# Altium schematic sheet 4_demodulation.SchDoc
size A; SheetNumber: 7; SheetTotal: 9
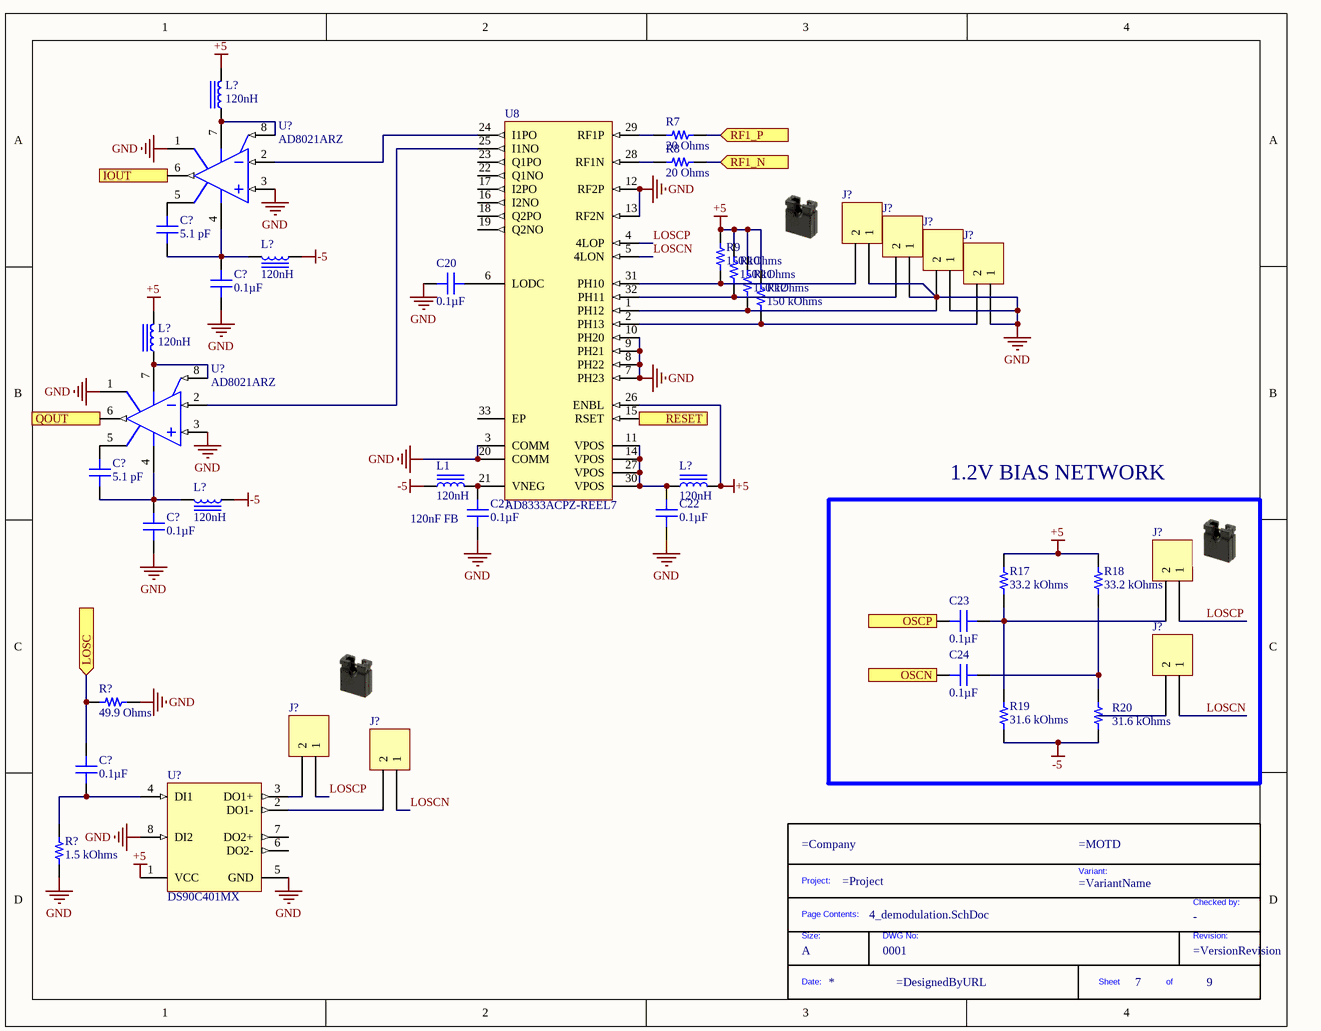
[diagram p0: 4_demodulation.SchDoc]

## Parts
(Parts that share a designator on the sheet are numbered #1, #2 ... from top to bottom, then left to right.)
*?  DWG No: 0001  Size: A  (hidden comment: TitleBlock)  (graphical)
C20  0.1µF  [CAP 1206_3216 - 1.0MM]
C21  0.1µF  [CAP 1206_3216 - 1.0MM]
C22  0.1µF  [CAP 1206_3216 - 1.0MM]
C23  0.1µF  [CAP 1206_3216 - 1.0MM]
C24  0.1µF  [CAP 1206_3216 - 1.0MM]
C?#1  5.1 pF  [CAP 1206_3216 - 0.8MM]
C?#2  0.1µF  [CAP 1206_3216 - 1.0MM]
C?#3  5.1 pF  [CAP 1206_3216 - 0.8MM]
C?#4  0.1µF  [CAP 1206_3216 - 1.0MM]
C?#5  0.1µF  [CAP 1206_3216 - 1.0MM]
J?#1  0022272021  [MOLEX KK 0022272021]  (value not drawn)
J?#2  0022272021  [MOLEX KK 0022272021]  (value not drawn)
J?#3  0022272021  [MOLEX KK 0022272021]  (value not drawn)
J?#4  0022272021  [MOLEX KK 0022272021]  (value not drawn)
J?#5  0022272021  [MOLEX KK 0022272021]  (value not drawn)
J?#6  0022272021  [MOLEX KK 0022272021]  (value not drawn)
J?#7  0022272021  [MOLEX KK 0022272021]  (value not drawn)
J?#8  0022272021  [MOLEX KK 0022272021]  (value not drawn)
L1  120nH  [IND 0603_1608 RF WW]
L?#1  120nH  [IND 0603_1608 RF WW]
L?#2  120nH  [IND 0603_1608 RF WW]
L?#3  120nH  [IND 0603_1608 RF WW]
L?#4  120nH  [IND 0603_1608 RF WW]
L?#5  120nH  [IND 0603_1608 RF WW]
R7  20 Ohms  [RES 1206_3216]
R8  20 Ohms  [RES 1206_3216]
R9  150 kOhms  [RES 1206_3216]
R10  150 kOhms  [RES 1206_3216]
R11  150 kOhms  [RES 1206_3216]
R12  150 kOhms  [RES 1206_3216]
R17  33.2 kOhms  [RES 1206_3216]
R18  33.2 kOhms  [RES 1206_3216]
R19  31.6 kOhms  [RES 1206_3216]
R20  31.6 kOhms  [RES 1206_3216]
R?#1  49.9 Ohms  [RES 1206_3216]
R?#2  1.5 kOhms  [RES 1206_3216]
U8  AD8333ACPZ-REEL7  [ADI-CP-32-2_L]
U?#1  AD8021ARZ  [ADI-R-8_N]
U?#2  AD8021ARZ  [ADI-R-8_N]
U?#3  DS90C401MX  [D0008A_N]

## Blocks framed on the sheet
1.2V BIAS NETWORK: C23 C24 J?#5 J?#6 R17-R20

## Ports
IOUT (out), LOSC (in), OSCN (in), OSCP (in), QOUT (out), RESET (in), RF1_N (in), RF1_P (in)

## Nets
+5: L?#1.2 L?#3.2 L?#4.2 R9.2 R10.2 R11.2 R12.2 R17.2 R18.2 U8.26(ENBL) U?#3.1(VCC)
-5: L1.1 L?#2.1 L?#5.1 R19.2 R20.1
GND: C20.2 C21.1 C22.1 C?#2.2 C?#4.2 J?#1.1 J?#2.1 J?#3.1 J?#4.1 R?#1.2 R?#2.2 U8.3(COMM) U8.7(PH23) U8.8(PH22) U8.9(PH21) U8.10(PH20) U8.12(RF2P) U8.13(RF2N) U8.20(COMM) U?#1.1(LOGIC_REFERENCE) U?#1.3(+IN) U?#2.1(LOGIC_REFERENCE) U?#2.3(+IN) U?#3.5(GND) U?#3.8(DI2)
IOUT: U?#1.6(VOUT) ; port IOUT
LOSC: C?#5.2 R?#1.1 ; port LOSC
LOSCN: J?#6.1 J?#8.1 U8.5(4LON)
LOSCP: J?#5.1 J?#7.1 U8.4(4LOP)
OSCN: C24.2 ; port OSCN
OSCP: C23.2 ; port OSCP
QOUT: U?#2.6(VOUT) ; port QOUT
RESET: U8.15(RSET) ; port RESET
RF1_N: R8.2 ; port RF1_N
RF1_P: R7.2 ; port RF1_P
NetC20_1: C20.1 U8.6(LODC)
NetC21_2: C21.2 L1.2 U8.21(VNEG)
NetC22_2: C22.2 L?#4.1 U8.11(VPOS) U8.14(VPOS) U8.27(VPOS) U8.30(VPOS)
NetC23_1: C23.1 J?#5.2 R17.1 R19.1
NetC24_1: C24.1 R18.1 R20.2
NetC?#1_1: C?#1.1 C?#2.1 L?#2.2 U?#1.4(-VS)
NetC?#1_2: C?#1.2 U?#1.5(CCOMP)
NetC?#3_1: C?#3.1 C?#4.1 L?#5.2 U?#2.4(-VS)
NetC?#3_2: C?#3.2 U?#2.5(CCOMP)
NetC?#5_1: C?#5.1 R?#2.1 U?#3.4(DI1)
NetJ?#1_2: J?#1.2 R9.1 U8.31(PH10)
NetJ?#2_2: J?#2.2 R10.1 U8.32(PH11)
NetJ?#3_2: J?#3.2 R11.1 U8.1(PH12)
NetJ?#4_2: J?#4.2 R12.1 U8.2(PH13)
NetJ?#7_2: J?#7.2 U?#3.3(DO1+)
NetJ?#8_2: J?#8.2 U?#3.2(DO1-)
NetL?#1_1: L?#1.1 U?#1.7(+VS) U?#1.8(~{DISABLE})
NetL?#3_1: L?#3.1 U?#2.7(+VS) U?#2.8(~{DISABLE})
NetR7_1: R7.1 U8.29(RF1P)
NetR8_1: R8.1 U8.28(RF1N)
NetU8_24: U8.24(I1PO) U?#1.2(-IN)
NetU8_25: U8.25(I1NO) U?#2.2(-IN)

Not connected (* = marked no-connect by the designer): J?#6 2; U8 16(I2NO) 17(I2PO) 18(Q2PO) 19(Q2NO) 22(Q1NO) 23(Q1PO) 33(EP); U?#3 6(DO2-) 7(DO2+)

## Notes on the sheet
- 120nF FB
- (in symbol TitleBlock) Project:; Variant:; Checked by:; Page Contents:; Size:; DWG No:; Revision:; Date:; Sheet; of

## Library data of the parts
*? = TitleBlock: Standard Title Block; Checked by: -
C20-C24 C?#2 C?#4 C?#5 = 12065C104JAT2A: CAP CER 0.1UF 50V X7R 1206; manufacturer: AVX Corporation; Tolerance: ±5%; Part Number: 12065C104JAT2A; Value: 0.1µF; Applications: General Purpose; Capacitance: 0.1µF; componentlink1description: Datasheet; componentlink1url: http://datasheets.avx.com/X7RDielectric.pdf; componentlink2description: DigiKey Link; componentlink2url: http://digikey.com/product-detail/en/avx-corporation/12065C104JAT2A/478-3797-1-ND/1116495; Device Package: 1206 (3216 Metric); lastupdated: 2020-09-02 01:05:06; Lifecycle Status: Active; Minimum Order: 1; Mounting Type: Surface Mount, MLCC; Operating Temperature: -55°C ~ 125°C; Package / Case: 1206 (3216 Metric); packaging: TapeAndReel; partid: 19088; Part Status: Active; price: 0.06; series: -; Size / Dimension: 0.126" L x 0.063" W (3.20mm x 1.60mm); Supplier 1: DigiKey; Supplier Part Number 1: 478-3797-1-ND; Temperature Coefficient: X7R; Thickness (Max): 0.037" (0.94mm); Voltage - Rated: 50V
C?#1 C?#3 = C1206C519C5GAC7800: CAP CER 5.1PF 50V C0G/NP0 1206; manufacturer: KEMET; Temperature Coefficient: C0G, NP0; Tolerance: ±0.25pF; Part Number: C1206C519C5GAC7800; Value: 5.1 pF; Applications: General Purpose; Capacitance: 5.1 pF; componentlink1description: Datasheet; componentlink1url: https://api.kemet.com/component-edge/download/datasheet/C1206C519C5GACTU.pdf; componentlink2description: DigiKey Link; componentlink2url: https://www.digikey.com/en/products/detail/kemet/C1206C519C5GAC7800/411185; Device Package: 1206 (3216 Metric); Features: Low ESL; lastupdated: 2023-04-30 19:15:17; Lifecycle Status: Active; Minimum Order: 1; Mounting Type: Surface Mount, MLCC; Operating Temperature: -55°C ~ 125°C; Package / Case: 1206 (3216 Metric); packaging: TapeAndReel; partid: 30067; Part Status: Active; price: 0.16; series: SMD Comm C0G; Size / Dimension: 0.126" L x 0.063" W (3.20mm x 1.60mm); Supplier 1: DigiKey; Supplier Part Number 1: 399-C1206C519C5GAC7800CT-ND; Thickness (Max): 0.035" (0.88mm); Voltage - Rated: 50V
J?#1-J?#8 = 0022272021: CONN HEADER VERT 2POS 2.54MM; Manufacturer: Molex; Contact Length - Mating: 0.295" (7.49mm); Contact Length - Post: 0.140" (3.56mm); Material Flammability Rating: UL94 V-0; Number of Positions: 2; Number of Positions Loaded: All; Overall Contact Length: 0.560" (14.22mm); Pitch - Mating: 0.100" (2.54mm); Shrouding: Shrouded - 1 Wall; Style: Board to Cable/Wire; Part Number: 0022272021; ComponentLink1Description: Datasheet; ComponentLink1URL: https://www.molex.com/pdm_docs/sd/022272021_sd.pdf; ComponentLink2Description: DigiKey Link; ComponentLink2URL: http://digikey.com/product-detail/en/molex/0022272021/WM4111-ND/1130577; Connector Type: Header; Contact Finish - Mating: Tin; Contact Finish - Post: Tin; Contact Finish Thickness - Mating: 100.0µin (2.54µm); Contact Material: Brass; Contact Shape: Square; Contact Type: Male Pin; Fastening Type: Friction Lock; Insulation Color: Natural; Insulation Height: 0.461" (11.70mm); Insulation Material: Polyamide (PA), Nylon; LastUpdated: 2020-01-12 23:51:43; Lifecycle Status: Active; Minimum Order: 1; Mounting Type: Through Hole; Number of Rows: 1; Packaging: Bulk; PartId: 76; Part Status: Active; Price: 0.27; Series: KK 6410; Supplier 1: DigiKey; Supplier Part Number 1: WM4111-ND; Termination: Solder
L1 = 744761212C: FIXED IND 120NH 300MA 650 MOHM; Manufacturer: Würth Elektronik; DC Resistance (DCR): 650mOhm Max; Frequency - Self Resonant: 1.3GHz; Inductance Frequency - Test: 150MHz; Material - Core: Ceramic; Q @ Freq: 30 @ 150MHz; Shielding: Unshielded; Tolerance: ±5%; Type: Wirewound; Part Number: 744761212C; ComponentLink1Description: Datasheet; ComponentLink1URL: https://katalog.we-online.de/pbs/datasheet/744761212C.pdf; ComponentLink2Description: DigiKey Link; ComponentLink2URL: http://digikey.com/product-detail/en/w-rth-elektronik/744761212C/732-1768-1-ND/1994348; Current Rating (Amps): 300mA; Device Package: 0603 (1608 Metric); Height - Seated (Max): 0.043" (1.10mm); Inductance: 120nH; LastUpdated: 2020-09-06 11:05:21; Lifecycle Status: Active; Minimum Order: 1; Mounting Type: Surface Mount; Operating Temperature: -40°C ~ 125°C; Package / Case: 0603 (1608 Metric); Packaging: TapeAndReel; PartId: 1481; Part Status: Active; Price: 0.23; Series: WE-KI; Size / Dimension: 0.065" L x 0.045" W (1.65mm x 1.15mm); Supplier 1: DigiKey; Supplier Part Number 1: 732-1768-1-ND; Supplier Device Package: 0603 (1608 Metric); Value: 120nH
L?#1-L?#5 = LQW18CAR12J00D: FIXED IND 120NH 1500MA 58MOHM; Manufacturer: Murata Electronics; Current Rating (Amps): 1.5A; DC Resistance (DCR): 58mOhm Max; Frequency - Self Resonant: 1.5GHz; Inductance Frequency - Test: 10MHz; Material - Core: Ferrite; Shielding: Unshielded; Tolerance: ±5%; Type: Wirewound; Part Number: LQW18CAR12J00D; ComponentLink1Description: Datasheet; ComponentLink1URL: https://search.murata.co.jp/Ceramy/image/img/P02/JELF243A-0159.pdf; ComponentLink2Description: DigiKey Link; ComponentLink2URL: http://digikey.com/product-detail/en/murata-electronics/LQW18CAR12J00D/490-18177-1-ND/9742079; Device Package: 0603 (1608 Metric); Height - Seated (Max): 0.037" (0.95mm); Inductance: 120nH; LastUpdated: 2020-09-06 11:05:19; Lifecycle Status: Active; Minimum Order: 1; Mounting Type: Surface Mount; Operating Temperature: -40°C ~ 85°C; Package / Case: 0603 (1608 Metric); Packaging: TapeAndReel; PartId: 1197; Part Status: Active; Price: 0.22; Series: LQW18; Size / Dimension: 0.063" L x 0.031" W (1.60mm x 0.80mm); Supplier 1: DigiKey; Supplier Part Number 1: 490-18177-1-ND; Supplier Device Package: 0603; Value: 120nH
R7 R8 = RNCP1206FTD20R0: RES 20 OHM 1% 1/2W 1206; Manufacturer: Stackpole Electronics Inc; Power (Watts): 0.5W, 1/2W; Temperature Coefficient: ±100ppm/°C; Part Number: RNCP1206FTD20R0; ComponentLink1Description: Datasheet; ComponentLink1URL: https://www.seielect.com/catalog/sei-rncp.pdf; ComponentLink2Description: DigiKey Link; ComponentLink2URL: https://www.digikey.com/en/products/detail/stackpole-electronics-inc/RNCP1206FTD20R0/2240306; Composition: Thin Film; Device Package: 1206 (3216 Metric); Features: Anti-Sulfur; Height - Seated (Max): 0.025" (0.65mm); LastUpdated: 2022-09-19 13:29:44; Lifecycle Status: Active; Minimum Order: 1; Number of Terminations: 2; Operating Temperature: -55°C ~ 155°C; Package / Case: 1206 (3216 Metric); Packaging: TapeAndReel; PartId: 29216; Part Status: Active; Price: 0.01; Resistance: 20 Ohms; Series: RNCP; Size / Dimension: 0.122" L x 0.059" W (3.10mm x 1.50mm); Supplier 1: DigiKey; Supplier Part Number 1: RNCP1206FTD20R0CT-ND; Supplier Device Package: 1206; Tolerance: ±1%; Value: 20 Ohms
R9-R12 = KTR18EZPF1503: RES SMD 150K OHM 1% 1/4W 1206; Manufacturer: Rohm Semiconductor; Power (Watts): 0.25W, 1/4W; Temperature Coefficient: ±100ppm/°C; Part Number: KTR18EZPF1503; ComponentLink1Description: Datasheet; ComponentLink1URL: https://www.rohm.com/datasheet/KTR03EZPF/ktr-e; ComponentLink2Description: DigiKey Link; ComponentLink2URL: https://www.digikey.com/en/products/detail/rohm-semiconductor/KTR18EZPF1503/1983702; Composition: Thick Film; Device Package: 1206 (3216 Metric); Features: Automotive AEC-Q200, High Voltage; Height - Seated (Max): 0.026" (0.65mm); LastUpdated: 2022-09-19 13:29:15; Lifecycle Status: Active; Minimum Order: 1; Number of Terminations: 2; Operating Temperature: -55°C ~ 155°C; Package / Case: 1206 (3216 Metric); Packaging: TapeAndReel; PartId: 35710; Part Status: Active; Price: 0.03; Ratings: AEC-Q200; Resistance: 150 kOhms; Series: KTR; Size / Dimension: 0.126" L x 0.063" W (3.20mm x 1.60mm); Supplier 1: DigiKey; Supplier Part Number 1: RHM150KAICT-ND; Supplier Device Package: 1206; Tolerance: ±1%; Value: 150 kOhms
R17 R18 = RK73H2BTTD3322F: RES 33.2K OHM 1% 1/4W 1206; Manufacturer: KOA Speer Electronics, Inc.; Power (Watts): 0.25W, 1/4W; Temperature Coefficient: ±100ppm/°C; Part Number: RK73H2BTTD3322F; ComponentLink1Description: Datasheet; ComponentLink1URL: http://www.koaspeer.com/catimages/Products/RK73H/RK73H.pdf; ComponentLink2Description: DigiKey Link; ComponentLink2URL: https://www.digikey.com/en/products/detail/koa-speer-electronics-inc/RK73H2BTTD3322F/10235905; Composition: Thick Film; Device Package: 1206 (3216 Metric); Features: Automotive AEC-Q200, Moisture Resistant; Height - Seated (Max): 0.028" (0.70mm); LastUpdated: 2022-09-19 13:29:27; Lifecycle Status: Active; Minimum Order: 1; Number of Terminations: 2; Operating Temperature: -55°C ~ 155°C; Package / Case: 1206 (3216 Metric); Packaging: CutTape; PartId: 33401; Part Status: Active; Price: 0.01; Ratings: AEC-Q200; Resistance: 33.2 kOhms; Series: RK73H; Size / Dimension: 0.126" L x 0.063" W (3.20mm x 1.60mm); Supplier 1: DigiKey; Supplier Part Number 1: 2019-RK73H2BTTD3322FCT-ND; Supplier Device Package: 1206; Tolerance: ±1%; Value: 33.2 kOhms
R19 R20 = RC1206FR-0731K6L: RES 31.6K OHM 1% 1/4W 1206; Manufacturer: Yageo; Power (Watts): 0.25W, 1/4W; Temperature Coefficient: ±100ppm/°C; Part Number: RC1206FR-0731K6L; ComponentLink1Description: Datasheet; ComponentLink1URL: https://www.yageo.com/upload/media/product/productsearch/datasheet/rchip/PYu-RC_Group_51_RoHS_L_10.pdf; ComponentLink2Description: DigiKey Link; ComponentLink2URL: https://www.digikey.com/en/products/detail/yageo/RC1206FR-0731K6L/728811; Composition: Thick Film; Device Package: 1206 (3216 Metric); Features: Moisture Resistant; Height - Seated (Max): 0.026" (0.65mm); LastUpdated: 2022-09-19 13:29:31; Lifecycle Status: Active; Minimum Order: 1; Number of Terminations: 2; Operating Temperature: -55°C ~ 155°C; Package / Case: 1206 (3216 Metric); Packaging: TapeAndReel; PartId: 32438; Part Status: Active; Price: 0.01; Resistance: 31.6 kOhms; Series: RC_L; Size / Dimension: 0.122" L x 0.063" W (3.10mm x 1.60mm); Supplier 1: DigiKey; Supplier Part Number 1: 311-31.6KFRCT-ND; Supplier Device Package: 1206; Tolerance: ±1%; Value: 31.6 kOhms
R?#1 = RT1206BRD0749R9L: RES SMD 49.9 OHM 0.1% 1/4W 1206; Manufacturer: Yageo; Power (Watts): 0.25W, 1/4W; Temperature Coefficient: ±25ppm/°C; Part Number: RT1206BRD0749R9L; ComponentLink1Description: Datasheet; ComponentLink1URL: https://www.yageo.com/upload/media/product/productsearch/datasheet/rchip/PYu-RT_1-to-0.01_RoHS_L_11.pdf; ComponentLink2Description: DigiKey Link; ComponentLink2URL: https://www.digikey.com/en/products/detail/yageo/RT1206BRD0749R9L/1079849; Composition: Thin Film; Device Package: 1206 (3216 Metric); Height - Seated (Max): 0.026" (0.65mm); LastUpdated: 2023-04-30 19:44:00; Lifecycle Status: Active; Minimum Order: 1; Number of Terminations: 2; Operating Temperature: -55°C ~ 155°C; Package / Case: 1206 (3216 Metric); Packaging: TapeAndReel; PartId: 26863; Part Status: Active; Price: 0.09; Resistance: 49.9 Ohms; Series: RT; Size / Dimension: 0.122" L x 0.063" W (3.10mm x 1.60mm); Supplier 1: DigiKey; Supplier Part Number 1: YAG5080CT-ND; Supplier Device Package: 1206; Tolerance: ±0.1%; Value: 49.9 Ohms
R?#2 = CRGP1206F1K5: RES 1.5K OHM 1% 1/2W 1206; Manufacturer: TE Connectivity Passive Product; Power (Watts): 0.5W, 1/2W; Temperature Coefficient: ±100ppm/°C; Part Number: CRGP1206F1K5; ComponentLink1Description: Datasheet; ComponentLink1URL: https://www.te.com/commerce/DocumentDelivery/DDEController?Action=srchrtrv&DocNm=9-1773463-9&DocType=DS&DocLang=English; ComponentLink2Description: DigiKey Link; ComponentLink2URL: https://www.digikey.com/en/products/detail/te-connectivity-passive-product/CRGP1206F1K5/8577142; Composition: Thick Film; Device Package: 1206 (3216 Metric); Features: Pulse Withstanding; Height - Seated (Max): 0.026" (0.65mm); LastUpdated: 2023-04-30 19:43:51; Lifecycle Status: Active; Minimum Order: 1; Number of Terminations: 2; Operating Temperature: -55°C ~ 155°C; Package / Case: 1206 (3216 Metric); Packaging: TapeAndReel; PartId: 27822; Part Status: Active; Price: 0.03; Resistance: 1.5 kOhms; Series: CRGP; Size / Dimension: 0.122" L x 0.061" W (3.10mm x 1.55mm); Supplier 1: DigiKey; Supplier Part Number 1: A130540CT-ND; Supplier Device Package: 1206; Tolerance: ±1%; Value: 1.5 kOhms
U8 = CMP-0285-00056-1: DC to 50 MHz, Dual I/Q Demodulator and Phase Shifter, CP-32-2, Pb-Free, 1500 Reel; Min RF Frequency (MHz): 0Hz; Amplitude Error (dB): 50mdB; IIP3 (+dBm): 30dBm; Phase Error (deg): 0.1Deg; Max RF Frequency (MHz): 50MHz; DatasheetVersion: Rev. D; ComponentLink1URL: www.analog.com; ComponentLink2Description: Datasheet; Code_JEDEC: MO-220-VHHD-2; ComponentLink3Description: Package Specification; PackageDescription: 32-Lead Lead Frame Chip Scale Package [LFCSP_VQ]; ComponentLink3URL: http://www.analog.com/static/imported-files/packages/414143737956480539664569CP_32_2.pdf; PackageReference: CP-32-2; ComponentLink1Description: Manufacturer URL; PackageVersion: Jan-2005; ComponentLink2URL: http://www.analog.com/static/imported-files/data_sheets/AD8333.pdf
U?#1 U?#2 = CMP-0384-00646-2: Single Channel Low Power Operational Amplifier, 490 MHz BW, 120 V/us SR, Industrial, 8-pin SOIC (R-8), Tube; Manufacturer: Analog Devices; Generic Part Number: AD8021; Small Signal Bandwidth: 490MHz; Iq/Amp: 7.7mA; V Span Max: 24V; V Span Min: 4.5V; Amplifiers Per Package: 1; Input Offset Voltage: 400uV; Input Bias Current: 7.5uA; Code_JEDEC: MS-012-AA; ComponentLink3Description: Package Specification; PackageDescription: 8-Pin Standard Small Outline Package, Body 3.9 x 4.9 mm, Pitch 1.27 mm; ComponentLink1URL: http://www.analog.com/en/index.html; PackageVersion: 060506-A; ComponentLink4Description: Reference Circuit; Mounting Technology: Surface Mount; ComponentLink4URL: http://www.analog.com/en/all-operational-amplifiers-op-amps/operational-amplifiers-op-amps/ad8021/products/product.html#product-recommendations; RevisionNote: Reference Circuit URL fixed; DatasheetVersion: Rev. F; ComponentLink2URL: http://www.analog.com/static/imported-files/data_sheets/AD8021.pdf; PackageReference: R-8; ComponentLink1Description: Manufacturer URL; ComponentLink3URL: http://www.analog.com/static/imported-files/packages/PKG_PDF/SOIC_Narrow%20(R)/R_8.pdf; ComponentLink2Description: Datasheet; Slew Rate: 120V/us; PartNumber: AD8021ARZ
U?#3 = CMP-0058-00917-3: Dual Low Voltage Differential Signaling (LVDS) Driver, 8 pin SOIC NARROW; Manufacturer: Texas Instruments; CompType: Interface IC; PackageTopMarking: NSZXTT*DS90C*401M; PowerWise: N; Code_JEDEC: MS-012-AA; PinCount: 8; RoHS: N; PackageDescription: SOIC Narrow, 4.9 x 3.9 x 1.45mm, 8 Lead, 1.27mm Pitch; Code_IPC: SOIC127P600-8; ComponentLink1Description: Datasheet URL; ComponentLink1URL: http://www.ti.com/general/docs/lit/getliterature.tsp?genericPartNumber=DS90C401&fileType=pdf; PackageReference: D0008A